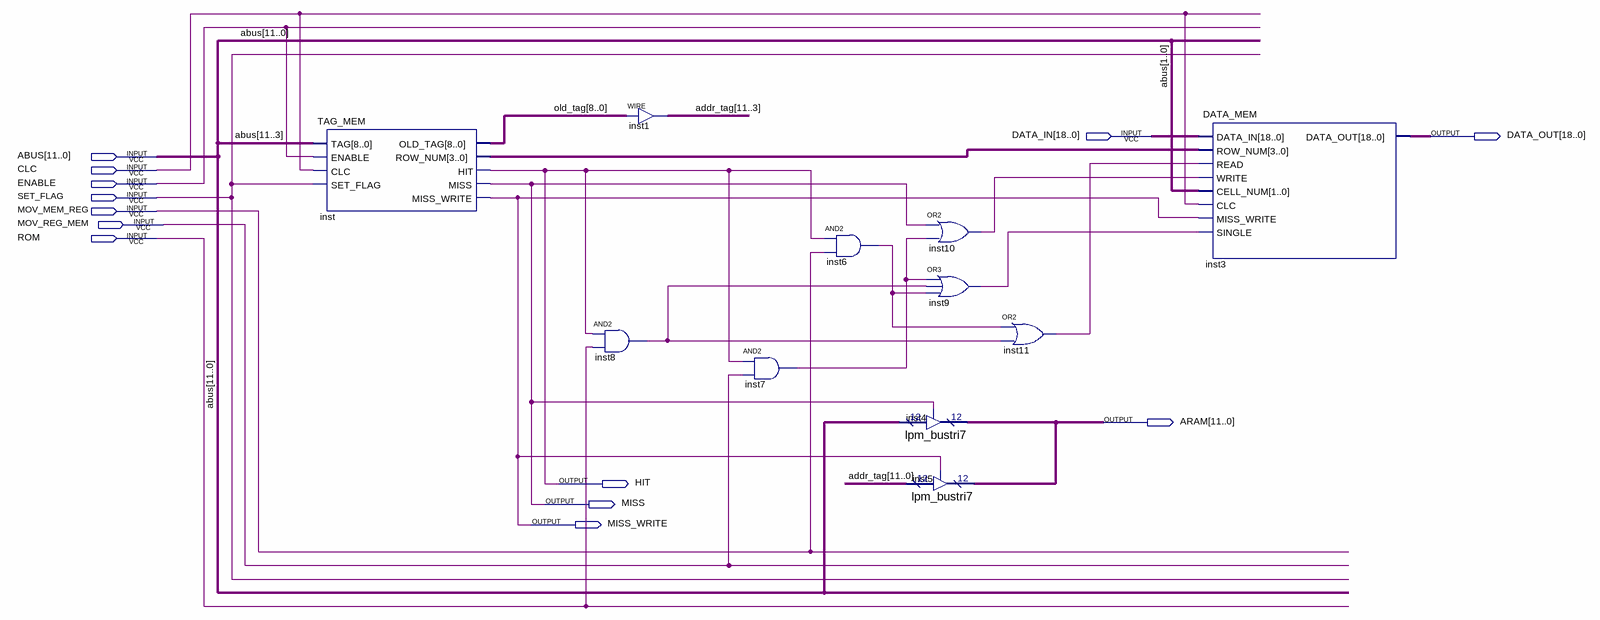
[diagram p0: schematic sheet]
// Quartus schematic SET.bdf as structural Verilog: 11 symbols, 13 pins
module SET (
  input  [18:0] DATA_IN,
  input  [11:0] ABUS,
  input  CLC,
  input  ENABLE,
  input  SET_FLAG,
  input  MOV_MEM_REG,
  input  MOV_REG_MEM,
  input  ROM,
  output [18:0] DATA_OUT,
  output [11:0] ARAM,
  output HIT,
  output MISS,
  output MISS_WRITE
);

  wire inst6_out, inst7_out, inst8_out, inst9_out, inst10_out, inst11_out;
  wire [3:0] inst_row_num;
  wire [8:0] old_tag;
  wire [11:0] addr_tag;

  TAG_MEM inst (
    .TAG(ABUS[11:3]), .ENABLE(ENABLE), .CLC(CLC), .SET_FLAG(SET_FLAG), .OLD_TAG(old_tag),
    .ROW_NUM(inst_row_num), .HIT(HIT), .MISS(MISS), .MISS_WRITE(MISS_WRITE));
  assign addr_tag[11:3] = old_tag;  // WIRE inst1
  and inst8 (inst8_out, HIT, ROM);
  and inst7 (inst7_out, HIT, MOV_REG_MEM);
  and inst6 (inst6_out, HIT, MOV_MEM_REG);
  lpm_bustri7 inst4 (.enabledt(MISS), .data(ABUS), .tridata(ARAM));
  lpm_bustri7 inst5 (.enabledt(MISS_WRITE), .data(addr_tag), .tridata(ARAM));
  or inst10 (inst10_out, MISS, inst7_out);
  or inst9 (inst9_out, inst7_out, inst8_out, inst6_out);
  or inst11 (inst11_out, inst6_out, inst8_out);
  DATA_MEM inst3 (
    .DATA_IN(DATA_IN), .ROW_NUM(inst_row_num), .READ(inst11_out), .WRITE(inst10_out), .CELL_NUM(ABUS[1:0]),
    .CLC(CLC), .MISS_WRITE(MISS_WRITE), .SINGLE(inst9_out), .DATA_OUT(DATA_OUT));
endmodule
